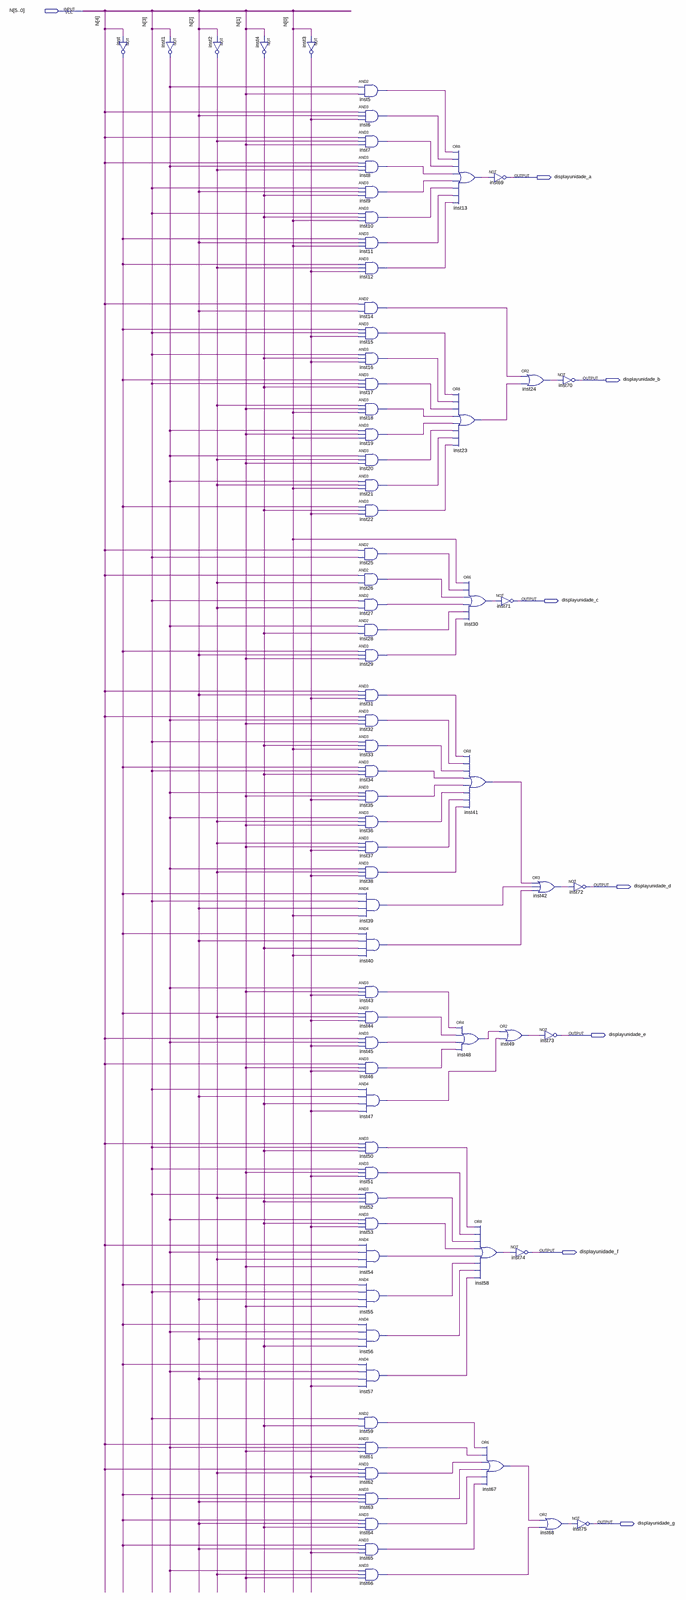
[diagram p0: schematic sheet, whole]
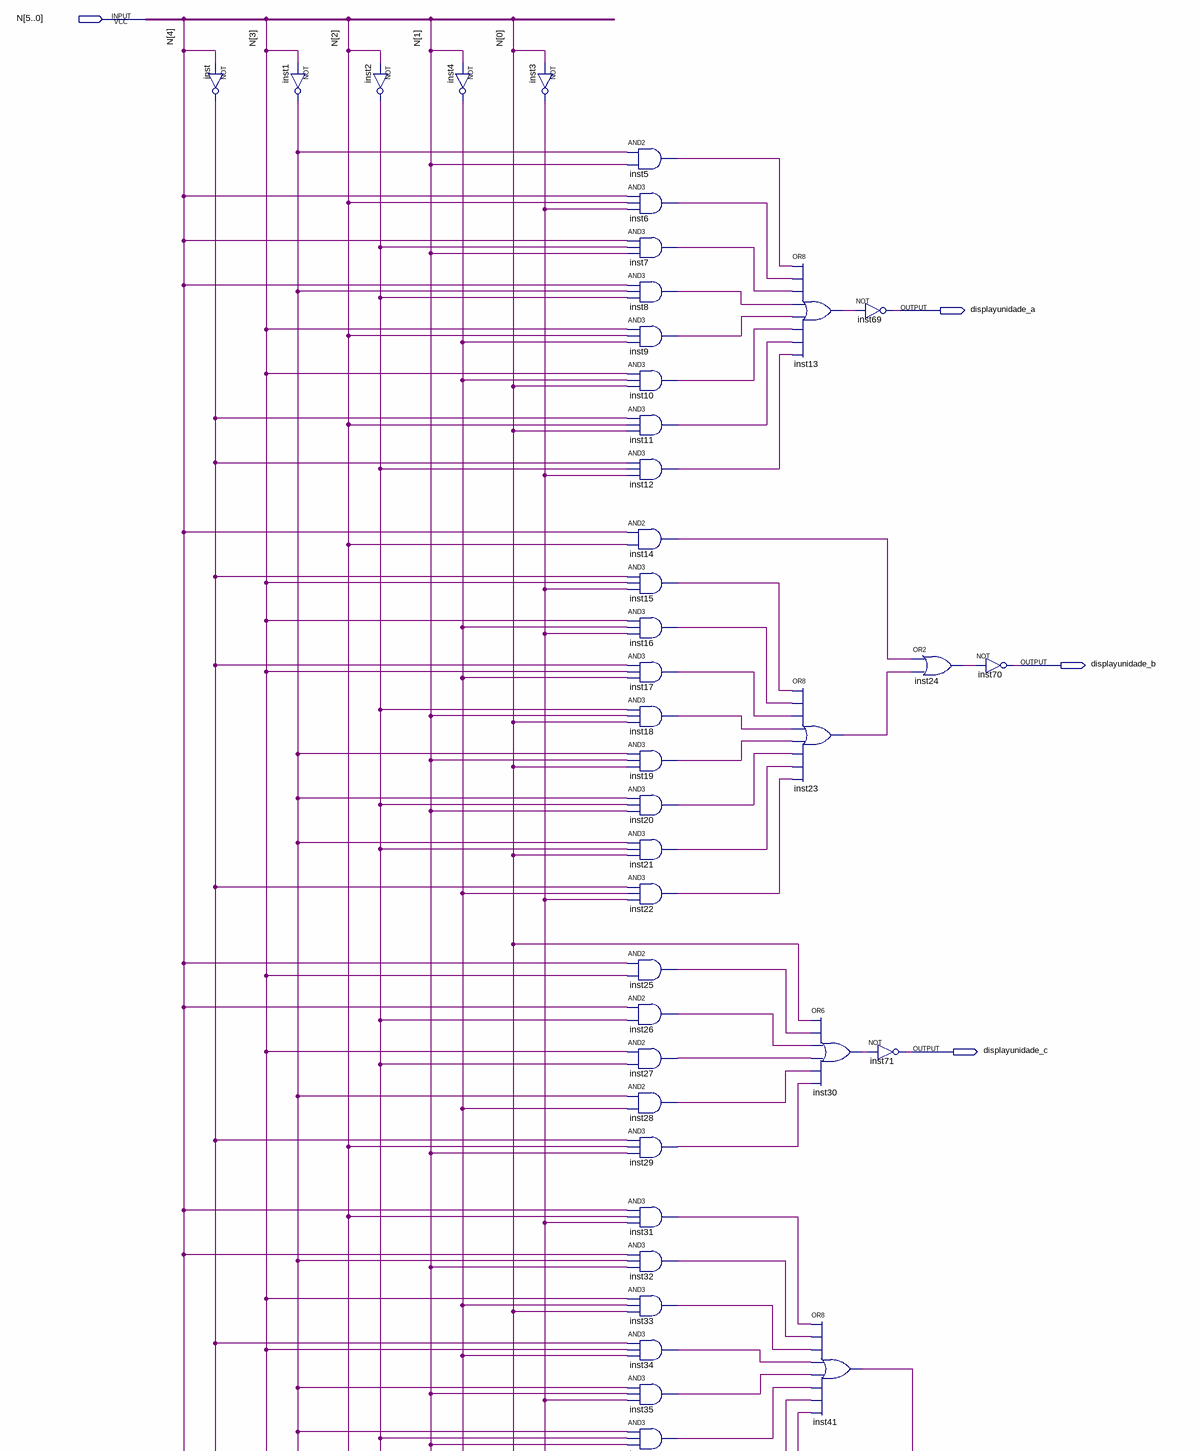
[diagram p1: schematic sheet, upper part]
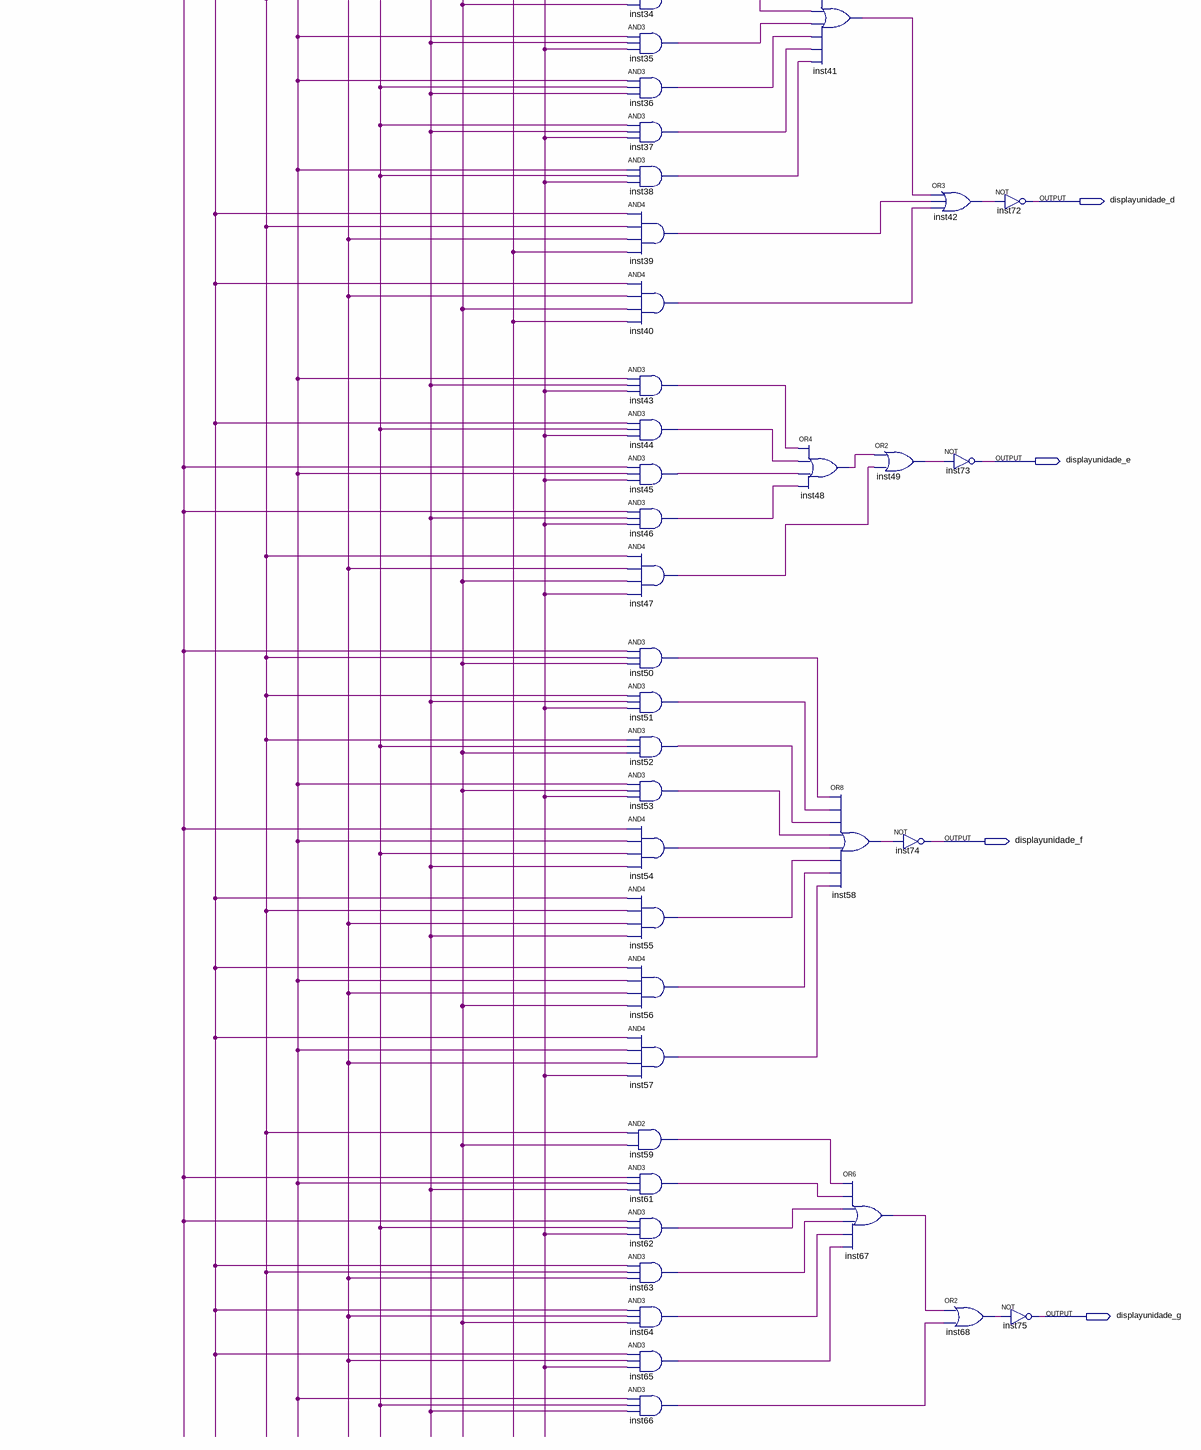
[diagram p2: schematic sheet, lower part]
// Quartus schematic displayunidade.bdf as structural Verilog: 75 symbols, 8 pins
module displayunidade (
  input  [5:0] N,
  output displayunidade_a,
  output displayunidade_b,
  output displayunidade_c,
  output displayunidade_d,
  output displayunidade_e,
  output displayunidade_f,
  output displayunidade_g
);

  wire inst1_out, inst2_out, inst3_out, inst4_out, inst5_out, inst6_out, inst7_out, inst8_out, inst9_out,
       inst10_out, inst11_out, inst12_out, inst13_out, inst14_out, inst15_out, inst16_out, inst17_out,
       inst18_out, inst19_out, inst20_out, inst21_out, inst22_out, inst23_out, inst24_out, inst25_out,
       inst26_out, inst27_out, inst28_out, inst29_out, inst30_out, inst31_out, inst32_out, inst33_out,
       inst34_out, inst35_out, inst36_out, inst37_out, inst38_out, inst39_out, inst40_out, inst41_out,
       inst42_out, inst43_out, inst44_out, inst45_out, inst46_out, inst47_out, inst48_out, inst49_out,
       inst50_out, inst51_out, inst52_out, inst53_out, inst54_out, inst55_out, inst56_out, inst57_out,
       inst58_out, inst59_out, inst61_out, inst62_out, inst63_out, inst64_out, inst65_out, inst66_out,
       inst67_out, inst68_out, inst_out;

  not inst (inst_out, N[4]);
  not inst1 (inst1_out, N[3]);
  not inst2 (inst2_out, N[2]);
  not inst4 (inst4_out, N[1]);
  not inst3 (inst3_out, N[0]);
  and inst5 (inst5_out, inst1_out, N[1]);
  and inst6 (inst6_out, N[4], N[2], inst3_out);
  and inst7 (inst7_out, N[4], inst2_out, N[1]);
  and inst8 (inst8_out, N[4], inst1_out, inst2_out);
  and inst9 (inst9_out, N[3], N[2], inst4_out);
  and inst10 (inst10_out, N[3], inst4_out, N[0]);
  and inst11 (inst11_out, inst_out, N[2], N[0]);
  and inst12 (inst12_out, inst_out, inst2_out, inst3_out);
  and inst14 (inst14_out, N[4], N[2]);
  and inst15 (inst15_out, inst_out, N[3], inst3_out);
  and inst16 (inst16_out, N[3], inst4_out, inst3_out);
  and inst17 (inst17_out, inst_out, N[3], inst4_out);
  and inst18 (inst18_out, inst2_out, N[1], N[0]);
  and inst19 (inst19_out, inst1_out, N[1], N[0]);
  and inst20 (inst20_out, inst1_out, inst2_out, N[1]);
  and inst21 (inst21_out, inst1_out, inst2_out, N[0]);
  and inst22 (inst22_out, inst_out, inst4_out, inst3_out);
  and inst25 (inst25_out, N[4], N[3]);
  and inst26 (inst26_out, N[4], inst2_out);
  and inst27 (inst27_out, N[3], inst2_out);
  and inst28 (inst28_out, inst1_out, inst4_out);
  and inst29 (inst29_out, inst_out, N[2], N[1]);
  and inst31 (inst31_out, N[4], N[2], inst3_out);
  and inst32 (inst32_out, N[4], inst1_out, N[1]);
  and inst33 (inst33_out, N[3], inst4_out, N[0]);
  and inst34 (inst34_out, inst_out, N[3], inst4_out);
  and inst35 (inst35_out, inst1_out, N[1], inst3_out);
  and inst36 (inst36_out, inst1_out, inst2_out, N[1]);
  and inst37 (inst37_out, inst2_out, N[1], inst3_out);
  and inst38 (inst38_out, inst1_out, inst2_out, inst3_out);
  and inst39 (inst39_out, inst_out, N[3], N[2], N[0]);
  and inst40 (inst40_out, inst_out, N[2], inst4_out, N[0]);
  and inst43 (inst43_out, inst1_out, N[1], inst3_out);
  and inst44 (inst44_out, inst_out, inst2_out, inst3_out);
  and inst45 (inst45_out, N[4], inst1_out, inst3_out);
  and inst46 (inst46_out, N[4], N[1], inst3_out);
  and inst47 (inst47_out, N[3], N[2], inst4_out, inst3_out);
  and inst50 (inst50_out, N[4], N[3], inst4_out);
  and inst51 (inst51_out, N[3], N[1], inst3_out);
  and inst52 (inst52_out, N[3], inst2_out, inst4_out);
  and inst53 (inst53_out, inst1_out, inst4_out, inst3_out);
  and inst54 (inst54_out, N[4], inst1_out, inst2_out, N[1]);
  and inst55 (inst55_out, inst_out, N[3], N[2], N[1]);
  and inst56 (inst56_out, inst_out, inst1_out, N[2], inst4_out);
  and inst57 (inst57_out, inst_out, inst1_out, N[2], inst3_out);
  and inst59 (inst59_out, N[3], inst4_out);
  and inst61 (inst61_out, N[4], inst1_out, N[1]);
  and inst62 (inst62_out, N[4], inst2_out, inst3_out);
  and inst63 (inst63_out, inst_out, N[3], N[2]);
  and inst64 (inst64_out, inst_out, N[2], inst4_out);
  and inst65 (inst65_out, inst_out, N[2], inst3_out);
  and inst66 (inst66_out, inst1_out, inst2_out, N[1]);
  or inst13 (inst13_out, inst5_out, inst6_out, inst7_out, inst8_out, inst9_out, inst10_out, inst11_out, inst12_out);
  or inst23 (inst23_out, inst15_out, inst16_out, inst17_out, inst18_out, inst19_out, inst20_out, inst21_out, inst22_out);
  or inst30 (inst30_out, N[0], inst25_out, inst26_out, inst27_out, inst28_out, inst29_out);
  or inst41 (inst41_out, inst31_out, inst32_out, inst33_out, inst34_out, inst35_out, inst36_out, inst37_out, inst38_out);
  or inst48 (inst48_out, inst43_out, inst44_out, inst45_out, inst46_out);
  not inst69 (displayunidade_a, inst13_out);
  not inst71 (displayunidade_c, inst30_out);
  or inst58 (inst58_out, inst50_out, inst51_out, inst52_out, inst53_out, inst54_out, inst55_out, inst56_out, inst57_out);
  or inst67 (inst67_out, inst59_out, inst61_out, inst62_out, inst63_out, inst64_out, inst65_out);
  or inst24 (inst24_out, inst14_out, inst23_out);
  or inst49 (inst49_out, inst48_out, inst47_out);
  not inst74 (displayunidade_f, inst58_out);
  or inst42 (inst42_out, inst41_out, inst39_out, inst40_out);
  not inst73 (displayunidade_e, inst49_out);
  or inst68 (inst68_out, inst67_out, inst66_out);
  not inst70 (displayunidade_b, inst24_out);
  not inst72 (displayunidade_d, inst42_out);
  not inst75 (displayunidade_g, inst68_out);
endmodule
